# Altium schematic sheet GSM_test.SchDoc
size A; SheetNumber: 4; SheetTotal: 5
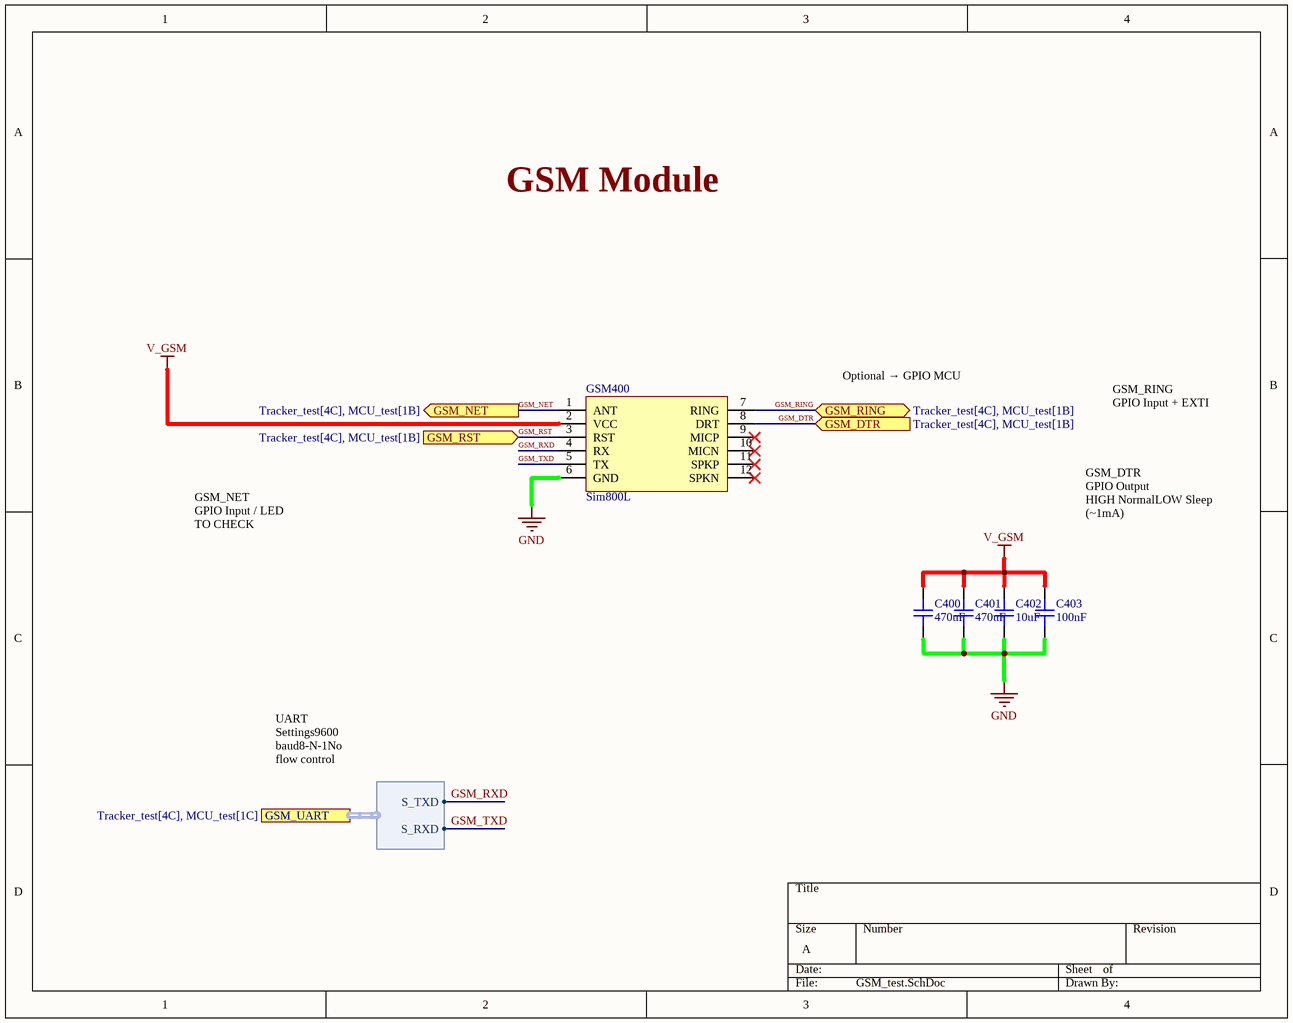
[diagram p0: GSM_test.SchDoc]

## Parts
C400  470uF  [CAP_1206]
C401  470uF  [CAP_1206]
C402  10uF  [CAP_1206]
C403  100nF  [CAP_0603]
GSM400  Sim800L  [Sim800L]

## Ports
GSM_DTR (in, see Tracker_test[4C], MCU_test[1B]), GSM_NET (out, see Tracker_test[4C], MCU_test[1B]), GSM_RING (bidir, see Tracker_test[4C], MCU_test[1B]), GSM_RST (in, see Tracker_test[4C], MCU_test[1B]), GSM_UART (harness GSM_UART, see Tracker_test[4C], MCU_test[1C])

## Harnesses
GSM_UART: S_TXD, S_RXD

## Nets
GND: C400.1 C401.1 C402.1 C403.1 GSM400.6(GND)
V_GSM: C400.2 C401.2 C402.2 C403.2 GSM400.2(VCC)
GSM_DTR: GSM400.8(DRT) ; port GSM_DTR
GSM_NET: GSM400.1(ANT) ; port GSM_NET
GSM_RING: GSM400.7(RING) ; port GSM_RING
GSM_RST: GSM400.3(RST) ; port GSM_RST
GSM_RXD: GSM400.4(RX) ; port GSM_UART.S_TXD
GSM_TXD: GSM400.5(TX) ; port GSM_UART.S_RXD

Not connected (* = marked no-connect by the designer): GSM400 9(MICP)* 10(MICN)* 11(SPKP)* 12(SPKN)*

## Notes on the sheet
- GSM Module
- Optional → GPIO MCU
- GSM_RING
  GPIO Input + EXTI
- GSM_NET
  GPIO Input / LED
  TO CHECK
- GSM_DTR
  GPIO Output
  HIGH	NormalLOW	Sleep (~1mA)
- UART Settings9600 baud8-N-1No flow control

## Library data of the parts
C400-C402 = CAP_1206: Capacitor SMD 1206; Manufacturer: *; Manufacturer Part Number: *; Distributor Link: *; LCSC: *; Rating: *; Dielectric: *
C403 = CAP_0603: Capacitor SMD 0603; Manufacturer: *; Manufacturer Part Number: *; Distributor Link: *; LCSC: *; Rating: *; Dielectric: *